# EAGLE design Stereo VCA (EAGLE 9.0.0)
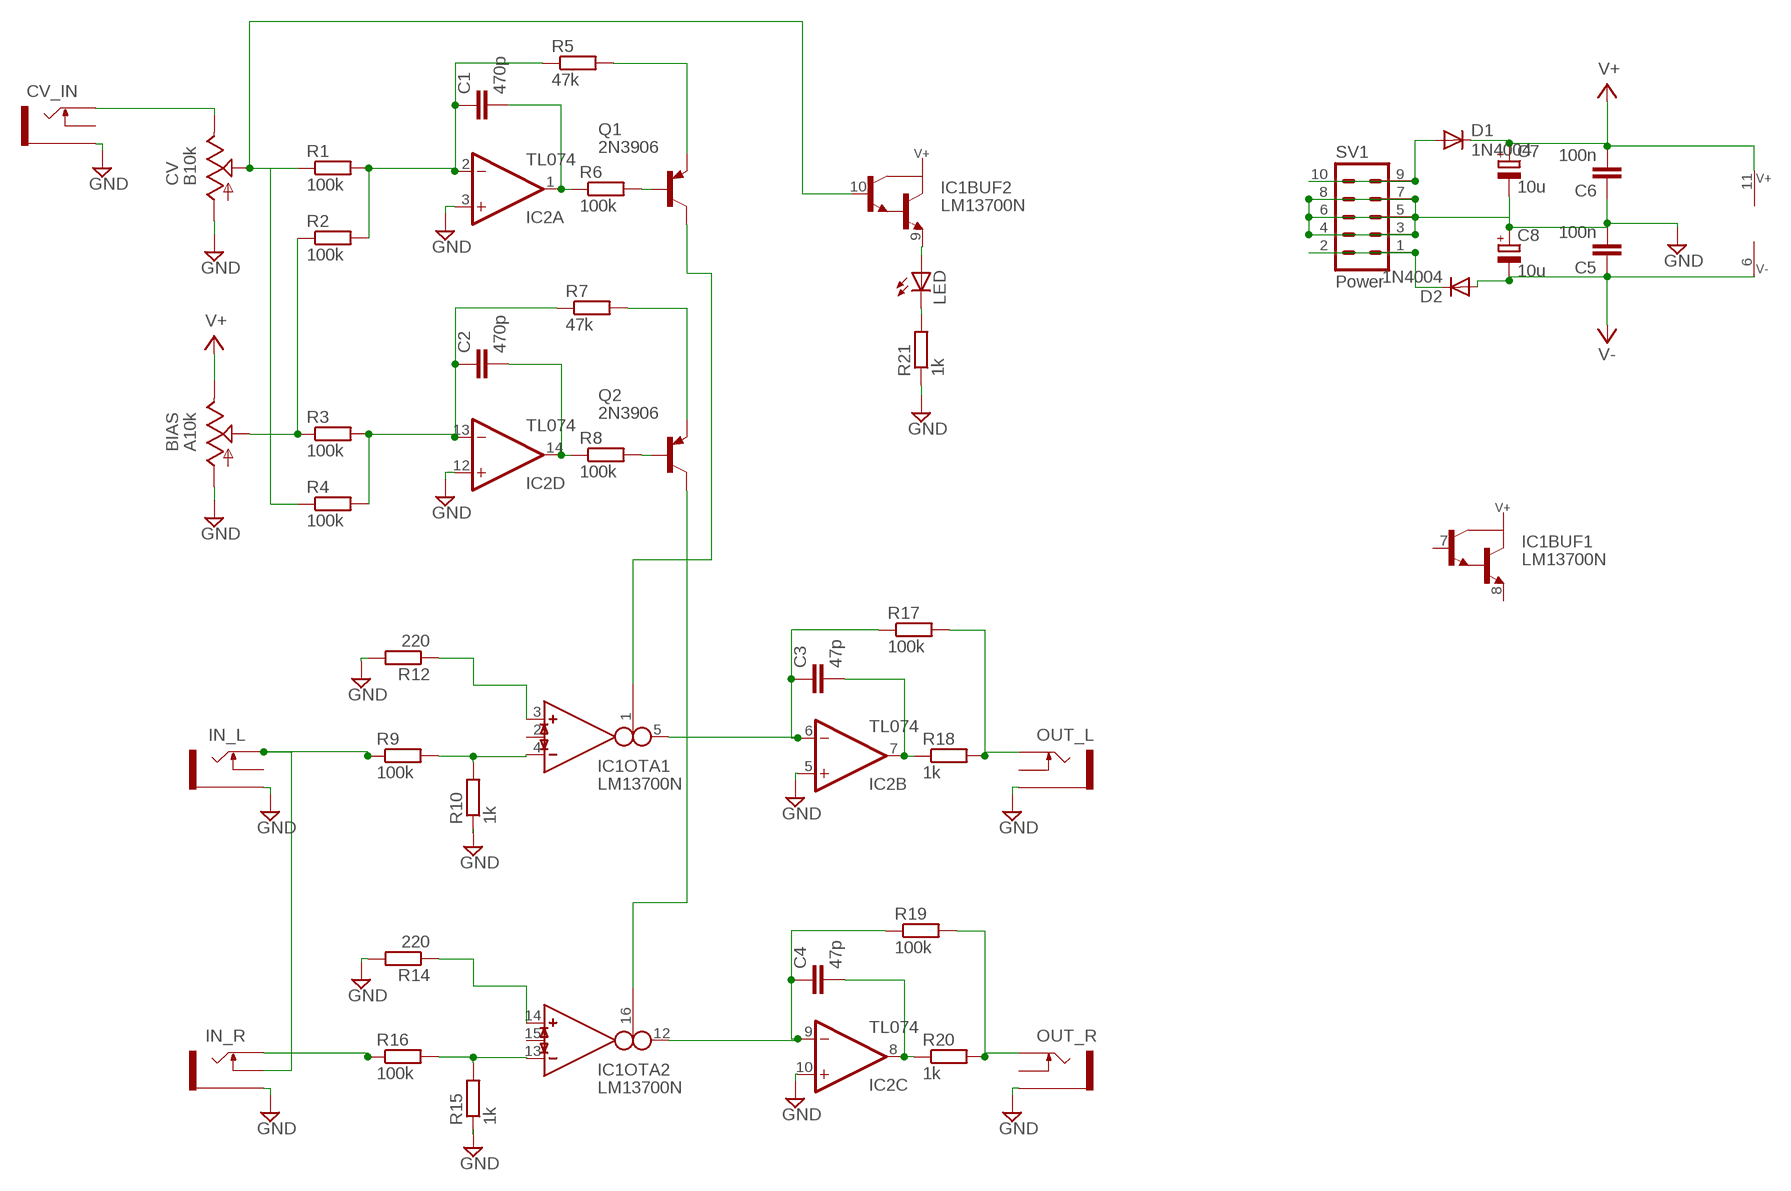
[diagram p0: schematic, sheet 1]

## Parts
BIAS  A10k  US-EVUE2A  [EVUE]
C1  470p  C-EU050-024X044  [C050-024X044]
C2  470p  C-EU050-024X044  [C050-024X044]
C3  47p  C-EU050-024X044  [C050-024X044]
C4  47p  C-EU050-024X044  [C050-024X044]
C5  100n  C-EU050-024X044  [C050-024X044]
C6  100n  C-EU050-024X044  [C050-024X044]
C7  10u  CPOL-EUE3.5-8  [E3,5-8]
C8  10u  CPOL-EUE3.5-8  [E3,5-8]
CV  B10k  US-EVUE2A  [EVUE]
CV_IN  PJ302M  [PJ302M]
D1  1N4004  [DO41-10]
D2  1N4004  [DO41-10]
IC1  LM13700N  [DIL16]
IC2  TL074  TL074_  [DIL14]
IN_L  PJ302M  [PJ302M]
IN_R  PJ302M  [PJ302M]
LED  LED3MM  [LED3MM]
OUT_L  PJ302M  [PJ302M]
OUT_R  PJ302M  [PJ302M]
Q1  2N3906  [TO92]
Q2  2N3906  [TO92]
R1  100k  R-EU_0204/7  [0204/7]
R2  100k  R-EU_0204/7  [0204/7]
R3  100k  R-EU_0204/7  [0204/7]
R4  100k  R-EU_0204/7  [0204/7]
R5  47k  R-EU_0204/7  [0204/7]
R6  100k  R-EU_0204/7  [0204/7]
R7  47k  R-EU_0204/7  [0204/7]
R8  100k  R-EU_0204/7  [0204/7]
R9  100k  R-EU_0204/7  [0204/7]
R10  1k  R-EU_0204/7  [0204/7]
R12  220  R-EU_0204/7  [0204/7]
R14  220  R-EU_0204/7  [0204/7]
R15  1k  R-EU_0204/7  [0204/7]
R16  100k  R-EU_0204/7  [0204/7]
R17  100k  R-EU_0204/7  [0204/7]
R18  1k  R-EU_0204/7  [0204/7]
R19  100k  R-EU_0204/7  [0204/7]
R20  1k  R-EU_0204/7  [0204/7]
R21  1k  R-EU_0204/7  [0204/7]
SV1  Power  EURO_POWER_HEADERFAT_PADS  [EURO_PWR_HEADER_FAT]

## Nets
GND: BIAS.1(A) C5.2 C6.1 C7.- C8.+ CV.1(A) CV_IN.GND(SLEEVE) IC2.3(A:+IN) IC2.5(B:+IN) IC2.10(C:+IN) IC2.12(D:+IN) IN_L.GND(SLEEVE) IN_R.GND(SLEEVE) OUT_L.GND(SLEEVE) OUT_R.GND(SLEEVE) R10.1 R12.2 R14.2 R15.1 R21.1 SV1.3 SV1.4 SV1.5 SV1.6 SV1.7 SV1.8
N$1: CV.3(E) CV_IN.TIP
N$2: BIAS.2(S) R2.1 R3.1
N$4: IC1.9(BUF2:E) LED.A
N$5: C2.1 IC2.13(D:-IN) R3.2 R4.2 R7.1
N$6: C1.2 IC2.1(A:OUT) R6.1
N$7: Q1.2(B) R6.2
N$8: Q1.3(E) R5.2
N$9: Q2.3(E) R7.2
N$10: C2.2 IC2.14(D:OUT) R8.1
N$11: IN_L.TIP IN_R.SW(SWITCH) R9.1
N$12: IC1.4(OTA1:IN_N) R9.2 R10.2
N$13: Q2.2(B) R8.2
N$14: IC1.3(OTA1:IN_P) R12.1
N$15: C1.1 IC2.2(A:-IN) R1.2 R2.2 R5.1
N$16: IC1.13(OTA2:IN_N) R15.2 R16.2
N$17: IC1.14(OTA2:IN_P) R14.1
N$18: C3.1 IC1.5(OTA1:OUT) IC2.6(B:-IN) R17.1
N$19: IC1.1(OTA1:I_BIAS) Q1.1(C)
N$20: C3.2 IC2.7(B:OUT) R18.1
N$21: OUT_L.TIP R17.2 R18.2
N$22: C4.1 IC1.12(OTA2:OUT) IC2.9(C:-IN) R19.1
N$23: IC1.16(OTA2:I_BIAS) Q2.1(C)
N$24: C4.2 IC2.8(C:OUT) R20.1
N$25: OUT_R.TIP R19.2 R20.2
N$26: IN_R.TIP R16.1
N$27: LED.K(C) R21.2
N$28: CV.2(S) IC1.10(BUF2:B) R1.1 R4.1
N$31: D2.C SV1.1 SV1.2
N$32: D1.A SV1.9 SV1.10
V+: BIAS.3(E) C6.2 C7.+ D1.C IC1.11(SUPPLY:V+)
V-: C5.1 C8.- D2.A IC1.6(SUPPLY:V-)
Unconnected: CV_IN.SW(SWITCH) IC1.2(OTA1:I_DIODE) IC1.7(BUF1:B) IC1.8(BUF1:E) IC1.15(OTA2:I_DIODE) IN_L.SW(SWITCH) OUT_L.SW(SWITCH) OUT_R.SW(SWITCH)

## Power pins joined to a net without a drawn wire
V+: IC2.4(P:V+)
V-: IC2.11(P:V-)

## Library data of the parts
BIAS CV = pot:US-EVU: 9 mm Square Rotary Potentiometers Source: Panasonic
C1-C6 = resistor:C-EU: CAPACITOR, European symbol
C7 C8 = resistor:CPOL-EU: POLARIZED CAPACITOR, European symbol
CV_IN IN_L IN_R OUT_L OUT_R = pj302m:PJ302M: PJ302M horizontal / right angled mount 3.5 mm jack socket
D1 D2 = diode:1N4004: DIODE general purpose rectifier, 1 A
IC1 = ota:LM13700: Dual OTA with buffers
IC2 = MusicThingModular:TL074: Generic Quad Op Amp
LED = led:LED: LED OSRAM: - CHIPLED LG R971, LG N971, LY N971, LG Q971, LY Q971, LO R971, LY R971 LH N974, LH R974 LS Q976, LO Q976, LY Q976 LO Q996 - Hyper CHIPLED LW Q18S LB Q993, LB Q99A, LB R99A - SideLED LS A670, LO A670, LY A670, LG A670, LP A670 LB A673, LV A673, LT A673, LW A673 LH A674 LY A675 LS A676, LA A676, LO A676, LY A676, LW A676 LS A679, LY A679, LG A679 - Hyper Micro SIDELED® LS Y876, LA Y876, LO Y876, LY Y876 LT Y87S - SmartLED LW L88C, LW L88S LB L89C, LB L89S, LG L890 LS L89K, LO L89K, LY L89K LS L896, LA L896, LO L896, LY L896 - TOPLED LS T670, LO T670, LY T670, LG T670, LP T670 LSG T670, LSP T670, LSY T670, LOP T670, LYG T670 LG T671, LOG T671, LSG T671 LB T673, LV T673, LT T673, LW T673 LH T674 LS T676, LA T676, LO T676, LY T676, LB T676, LH T676, LSB T676, LW T676 LB T67C, LV T67C, LT T67C, LS T67K, LO T67K, LY T67K, LW E67C LS E67B, LA E67B, LO E67B, LY E67B, LB E67C, LV E67C, LT E67C LW T67C LS T679, LY T679, LG T679 LS T770, LO T770, LY T770, LG T770, LP T770 LB T773, LV T773, LT T773, LW T773 LH T774 LS E675, LA E675, LY E675, LS T675 LS T776, LA T776, LO T776, LY T776, LB T776 LHGB T686 LT T68C, LB T68C - Hyper Mini TOPLED® LB M676 - Mini TOPLED Santana® LG M470 LS M47K, LO M47K, LY M47K Source: http://www.osram.convergy.de LUXEON: - LUMILED® LXK2-PW12-R00, LXK2-PW12-S00, LXK2-PW14-U00, LXK2-PW14-V00 LXK2-PM12-R00, LXK2-PM12-S00, LXK2-PM14-U00 LXK2-PE12-Q00, LXK2-PE12-R00, LXK2-PE12-S00, LXK2-PE14-T00, LXK2-PE14-U00 LXK2-PB12-K00, LXK2-PB12-L00, LXK2-PB12-M00, LXK2-PB14-N00, LXK2-PB14-P00, LXK2-PB14-Q00 LXK2-PR12-L00, LXK2-PR12-M00, LXK2-PR14-Q00, LXK2-PR14-R00 LXK2-PD12-Q00, LXK2-PD12-R00, LXK2-PD12-S00 LXK2-PH12-R00, LXK2-PH12-S00 LXK2-PL12-P00, LXK2-PL12-Q00, LXK2-PL12-R00 Source: www.luxeon.com KINGBRIGHT: KA-3528ASYC Source: www.kingbright.com
Q1 Q2 = transistor-pnp:2N3906: PNP Transistor
R1-R10 R12 R14-R21 = resistor:R-EU_: RESISTOR, European symbol
SV1 = MusicThingModular:EURO_POWER_HEADER: Power Header 10 pin power header for Eurorack Power Supplies Variants with fatter pads for easier soldering, and the LOCK variant which has 5mil offset pins to hold the component in place before soldering

## Board
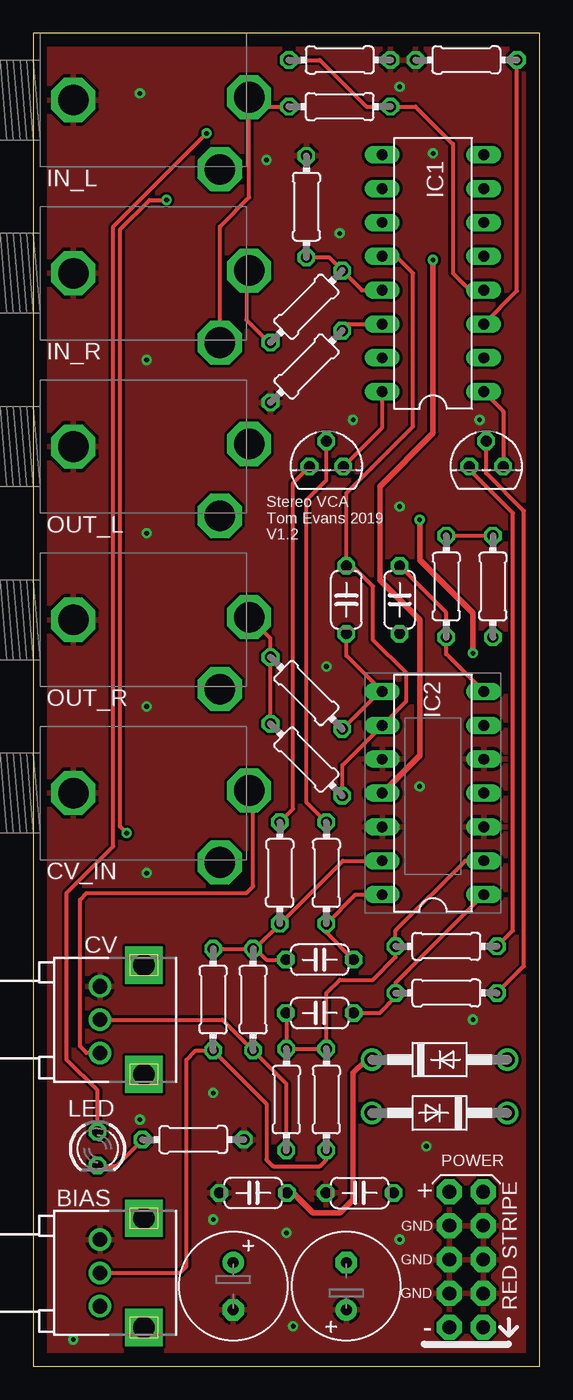
[diagram p1: board, top side]
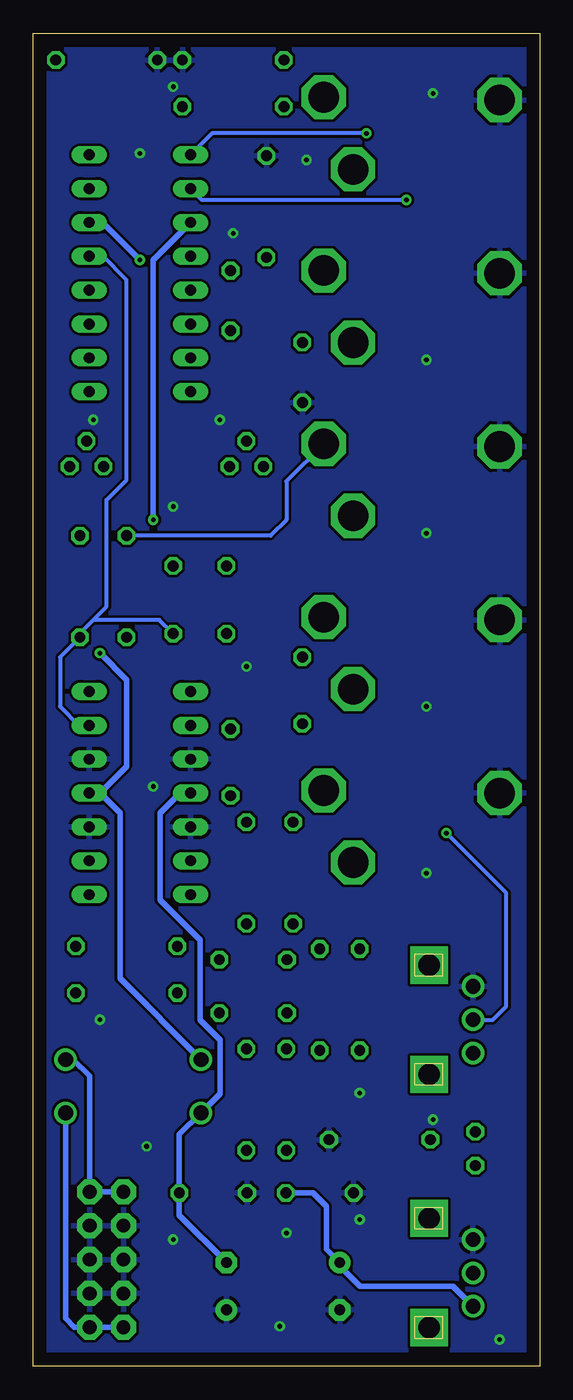
[diagram p2: board, bottom side, seen from below]

Size 38 x 100 mm. Coordinates in mm from the lower left corner, seen from the top.
Outline: 0,0 38,0 38,100 0,100 0,0
Copper layers (1*16): Top 0.035mm / dielectric 1.5mm / Bottom 0.035mm
Design rules "default *": minimum track width 12mil, minimum drill 0.35mm, track to track 8mil, track to pad 8mil, pad to pad 8mil, via to via 8mil, smd to smd 6mil, copper to edge 40mil, drill to drill 8mil, minimum pad ring 10mil, minimum via ring 8mil, stop-mask expansion 4mil, vias tented up to drill 0mil, thermal gap 10mil

### Footprints (pad centres in the part's own frame; a part is rotated, then mirrored left to right if it is on the bottom)
EVUE = drill 1.1 pad 1.676: 1 0,-2.5; 2 0,0; 3 0,2.5 | drill 1.6 pad 2.8 square: M1 -3.3,4.1; M2 -3.3,-4.1
C050-024X044 = drill 0.813 octagon: 1 -2.54,0; 2 2.54,0
E3,5-8 = drill 0.813 pad 1.6: + -1.778,0 | drill 0.813 pad 1.6 octagon: - 1.778,0
PJ302M = drill 2.3 pad 3.3 octagon: GND 2.5,0; SW 13.5,-5.2; TIP 15.7,0.2
DO41-10 = drill 1.118: A 5.08,0; C -5.08,0
DIL16 = drill 0.813 long: 1 -8.89,-3.81; 2 -6.35,-3.81; 3 -3.81,-3.81; 4 -1.27,-3.81; 5 1.27,-3.81; 6 3.81,-3.81; 7 6.35,-3.81; 8 8.89,-3.81; 9 8.89,3.81; 10 6.35,3.81; 11 3.81,3.81; 12 1.27,3.81; 13 -1.27,3.81; 14 -3.81,3.81; 15 -6.35,3.81; 16 -8.89,3.81
DIL14 = drill 0.813 long: 1 -7.62,-3.81; 2 -5.08,-3.81; 3 -2.54,-3.81; 4 0,-3.81; 5 2.54,-3.81; 6 5.08,-3.81; 7 7.62,-3.81; 8 7.62,3.81; 9 5.08,3.81; 10 2.54,3.81; 11 0,3.81; 12 -2.54,3.81; 13 -5.08,3.81; 14 -7.62,3.81
LED3MM = drill 0.813 octagon: A -1.27,0; K 1.27,0
TO92 = drill 0.813 octagon: 1 1.27,0; 2 0,1.905; 3 -1.27,0
0204/7 = drill 0.813 octagon: 1 -3.81,0; 2 3.81,0
EURO_PWR_HEADER_FAT = drill 1.016 pad 1.88 octagon: 1 -5.08,-1.27; 2 -5.08,1.27; 3 -2.54,-1.27; 4 -2.54,1.27; 5 0,-1.27; 6 0,1.27; 7 2.54,-1.27; 8 2.54,1.27; 9 5.08,-1.27; 10 5.08,1.27

### Placement (x,y rotation side)
BIAS  5,7 180 top
C1  21.5,26.5 0 top
C2  21.5,30.5 0 top
C3  27.5,57.5 90 top
C4  23.5,57.5 270 top
C5  24.5,13 180 top
C6  16.5,13 0 top
C7  15,6 270 top
C8  23.5,6 90 top
CV  5,26 180 top
CV_IN  0.5,43 0 top
D1  30.5,23 0 top
D2  30.5,19 180 top
IC1  30,82 90 top
IC2  30,43 90 top
IN_L  0.5,95 0 top
IN_R  0.5,82 0 top
LED  4.82,16.32 270 top
OUT_L  0.5,69 0 top
OUT_R  0.5,56 0 top
Q1  34,67.5 0 top
Q2  22,67.5 0 top
R1  19,20 90 top
R2  22,20 90 top
R3  13.5,27.5 90 top
R4  16.5,27.5 90 top
R5  31,31.5 0 top
R6  31,28 0 top
R7  18.5,37 90 top
R8  22,37 90 top
R9  23,94.5 0 top
R10  23,98 180 top
R12  32.5,98 180 top
R14  20.5,75 225 top
R15  20.5,87 270 top
R16  20.5,79.5 45 top
R17  34.5,58.5 90 top
R18  31,58.5 90 top
R19  20.5,45.5 135 top
R20  20.5,50.5 135 top
R21  12,17 180 top
SV1  32.5,8 90 top

### Tracks (layer width: path | path; a pad name or v marks a point on that pad's centre or on a via)
GND  (via drill 0.35)
  other vias: 33.5,71 8.5,75.5 8.5,62.5 8.5,49.5 8.5,37 8,18.5 13.5,20.5 27.5,9.5 19,10 13.5,11 3,2 19.5,3 29.5,16.5 33,26 29,43.5 22,52.5 27.5,64.5 24,71 23,85 17.5,90.5 27.5,96 8,95.5 30,91
  pour Top: 38,0 38,100 0,100 0,0
  pour Bottom: 0,100 0,0 38,0 38,100
N$1
  Top 0.305: CV.3 4,23.5 3.5,24 3.5,35 4,35.5 16,35.5 16.5,36 16.5,42.9 CV_IN.TIP
N$2
  Top 0.305: BIAS.2 11,7 11.5,7.5 11.5,23 12.19,23.69 R3.1 17.5,19.69 17.5,15.5 18,15 21.5,15 22,15.5 R2.1
N$4  (via drill 0.35)
  Top 0.305: LED.A 4.82,20.68 2.5,23 2.5,35.5 6,39 6,85.5 v13,92.5
  Bottom 0.305: v13,92.5 24.58,92.5 IC1.9
N$5
  Top 0.305: R3.2 R4.2 | R4.2 16.62,31.31 R7.1 23.23,37.92 IC2.13 | R4.2 16.69,31.31 17.5,30.5 C2.1
N$6
  Top 0.305: C1.2 26,26.5 27.19,27.69 R6.1 27.19,28.76 IC2.1
N$7
  Top 0.305: R6.2 36.83,30.02 36.83,64.17 34,67 Q1.2
N$8
  Top 0.305: R5.2 36,32.69 36,64 32.73,67.27 Q1.3
N$9
  Top 0.305: R7.2 19.5,41.81 19.5,66.27 Q2.3
N$10
  Top 0.305: C2.2 22,32.54 R8.1 24.19,35.38 IC2.14
N$11
  Top 0.305: IN_R.SW 14,85.5 16.2,87.7 IN_L.TIP 16.9,94.5 R9.1
N$12
  Top 0.305: IC1.4 32.77,80.73 31.5,82 31.5,91.69 28.69,94.5 R9.2 25,94.5 21.5,98 R10.2
N$13
  Top 0.305: R8.2 20.5,42.31 20.5,65 22,66.5 Q2.2
N$14
  Top 0.305: IC1.3 36.31,80.69 R12.1
N$15
  Top 0.305: C1.1 19,26.46 R1.2 R2.2 22,28 23,29 25.5,29 27.19,30.69 R5.1 27.19,32.69 32.42,37.92 IC2.2
N$16
  Top 0.305: 26.11,80.81 IC1.13 24.66,80.73 R16.2 22.2,83.19 R15.2
N$17
  Top 0.305: R14.1 23.69,78.19 IC1.14
N$18
  Bottom 0.305: C3.1 28.54,56 33.5,56 | 33.5,56 34.5,55 R17.1 36,53.19 36,49.5 34.58,48.08 IC2.6 | 33.5,56 32.5,57 32.5,65 31,66.5 31,81.5 32.77,83.27 IC1.5
N$19
  Top 0.305: IC1.1 35.27,71.65 Q1.1
N$20
  Top 0.305: IC2.7 31,53.43 R18.1 31,56.54 C3.2
N$21
  Top 0.305: R18.2 R17.2
  Bottom 0.305: OUT_L.TIP 19,66.4 19,63.5 20.19,62.31 R18.2
N$22
  Top 0.305: R19.1 23.19,45.08 IC2.9 28,49.89 28,52 25.5,54.5 25.5,58.5 23.96,60.04 C4.1 23.5,65.5 28.5,70.5 28.5,82 27.23,83.27 IC1.12
N$23
  Top 0.305: Q2.1 26.19,70.42 IC1.16
N$24
  Top 0.305: R20.1 26.01,50.62 IC2.8 23.5,53.31 C4.2
N$25
  Top 0.305: R19.2 R20.2 17.81,54.59 OUT_R.TIP
N$26
  Top 0.305: IN_R.TIP 16,82 16,78.5 17.69,76.81 R16.1
N$27
  Top 0.305: LED.K 6.24,15.05 R21.2
N$28  (via drill 0.35)
  Top 0.305: R1.1 19,21.19 R4.1 14.19,26 CV.2 | v7,40 6.51,40.49 6.51,85.29 8.72,87.5 v10,87.5
  Bottom 0.305: CV.2 3.5,26 2.5,27 2.5,35.5 v7,40 | v10,87.5 25.34,87.5 IC1.10
N$31
  Bottom 0.406: SV1.2 SV1.1 34.92,2.92 35.58,3.58 D2.C
N$32
  Bottom 0.406: SV1.10 SV1.9 33.77,21.77 35,23 D1.A
V+  (via drill 0.35)
  Top 0.406: C6.2 19.5,13 21,11.5 23,11.5 24,12.5 24,22 25,23 D1.C | v29,63.5 29,60.5 33,56.5 v33,53.5
  Bottom 0.406: BIAS.3 6.5,6 13.5,6 15,7.5 C7.+ 16,8.78 16,12 17,13 C6.2 | D1.C 31.5,29.08 31.5,41.5 33,43 | 33,43 IC2.4 | IC1.11 29,83 v29,63.5 | v33,53.5 31,51.5 31,45 33,43
V-  (via drill 0.35)
  Top 0.406: IC2.11 29,45.81 29,56 26,59 26,66 30,70 v30,83
  Bottom 0.406: C8.- 27.04,11.32 C5.1 27.04,17.38 D2.A 24,20.42 24,24.5 25.5,26 25.5,32 28.5,35 28.5,41.5 27,43 IC2.11 | v30,83 32.81,85.81 IC1.6

### Text on the board
tNames: Stereo VCA / Tom Evans 2019 / V1.2